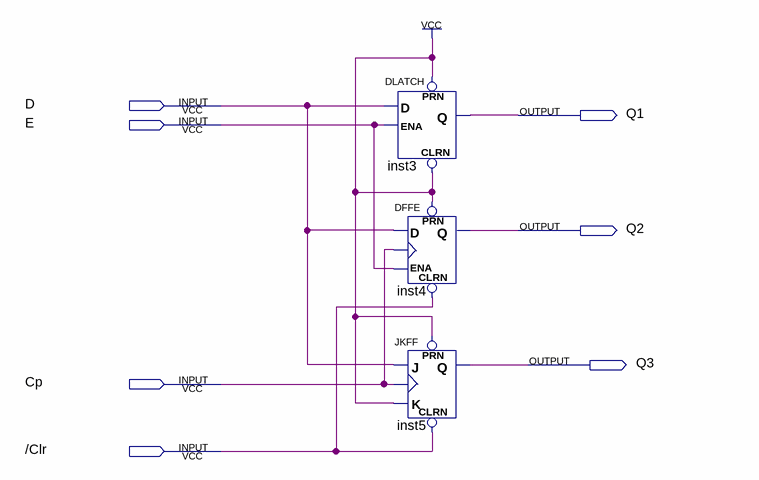
[diagram p0: schematic sheet]
// Quartus schematic ex10_19.bdf as structural Verilog: 3 symbols, 7 pins
module ex10_19 (
  input  D,
  input  E,
  input  Cp,
  input  \/Clr ,
  output Q1,
  output Q2,
  output Q3
);

  DLATCH inst3 (.CLRN(1'b1), .D(D), .ENA(E), .PRN(1'b1), .Q(Q1));
  DFFE inst4 (.PRN(1'b1), .CLRN(\/Clr ), .D(D), .CLK(Cp), .ENA(E), .Q(Q2));
  JKFF inst5 (.PRN(1'b1), .CLRN(\/Clr ), .K(1'b1), .J(D), .CLK(Cp), .Q(Q3));
endmodule
